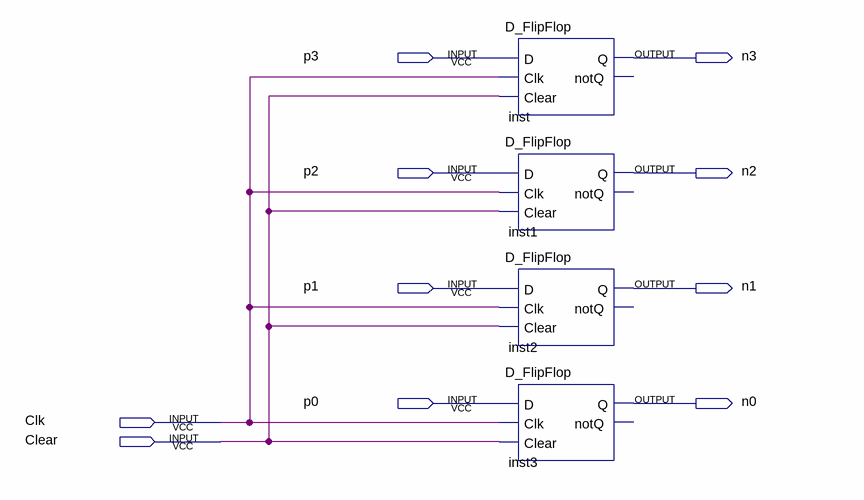
[diagram p0: schematic sheet]
// Quartus schematic 4bit_D_Flipflop.bdf as structural Verilog: 4 symbols, 10 pins
module \4bit_D_Flipflop  (
  input  p3,
  input  p2,
  input  p1,
  input  p0,
  input  Clk,
  input  Clear,
  output n3,
  output n2,
  output n1,
  output n0
);

  D_FlipFlop inst (.D(p3), .Clk(Clk), .Clear(Clear), .Q(n3));  // open: notQ
  D_FlipFlop inst1 (.D(p2), .Clk(Clk), .Clear(Clear), .Q(n2));  // open: notQ
  D_FlipFlop inst2 (.D(p1), .Clk(Clk), .Clear(Clear), .Q(n1));  // open: notQ
  D_FlipFlop inst3 (.D(p0), .Clk(Clk), .Clear(Clear), .Q(n0));  // open: notQ
endmodule
